# Altium schematic sheet modified.SchDoc
size A3
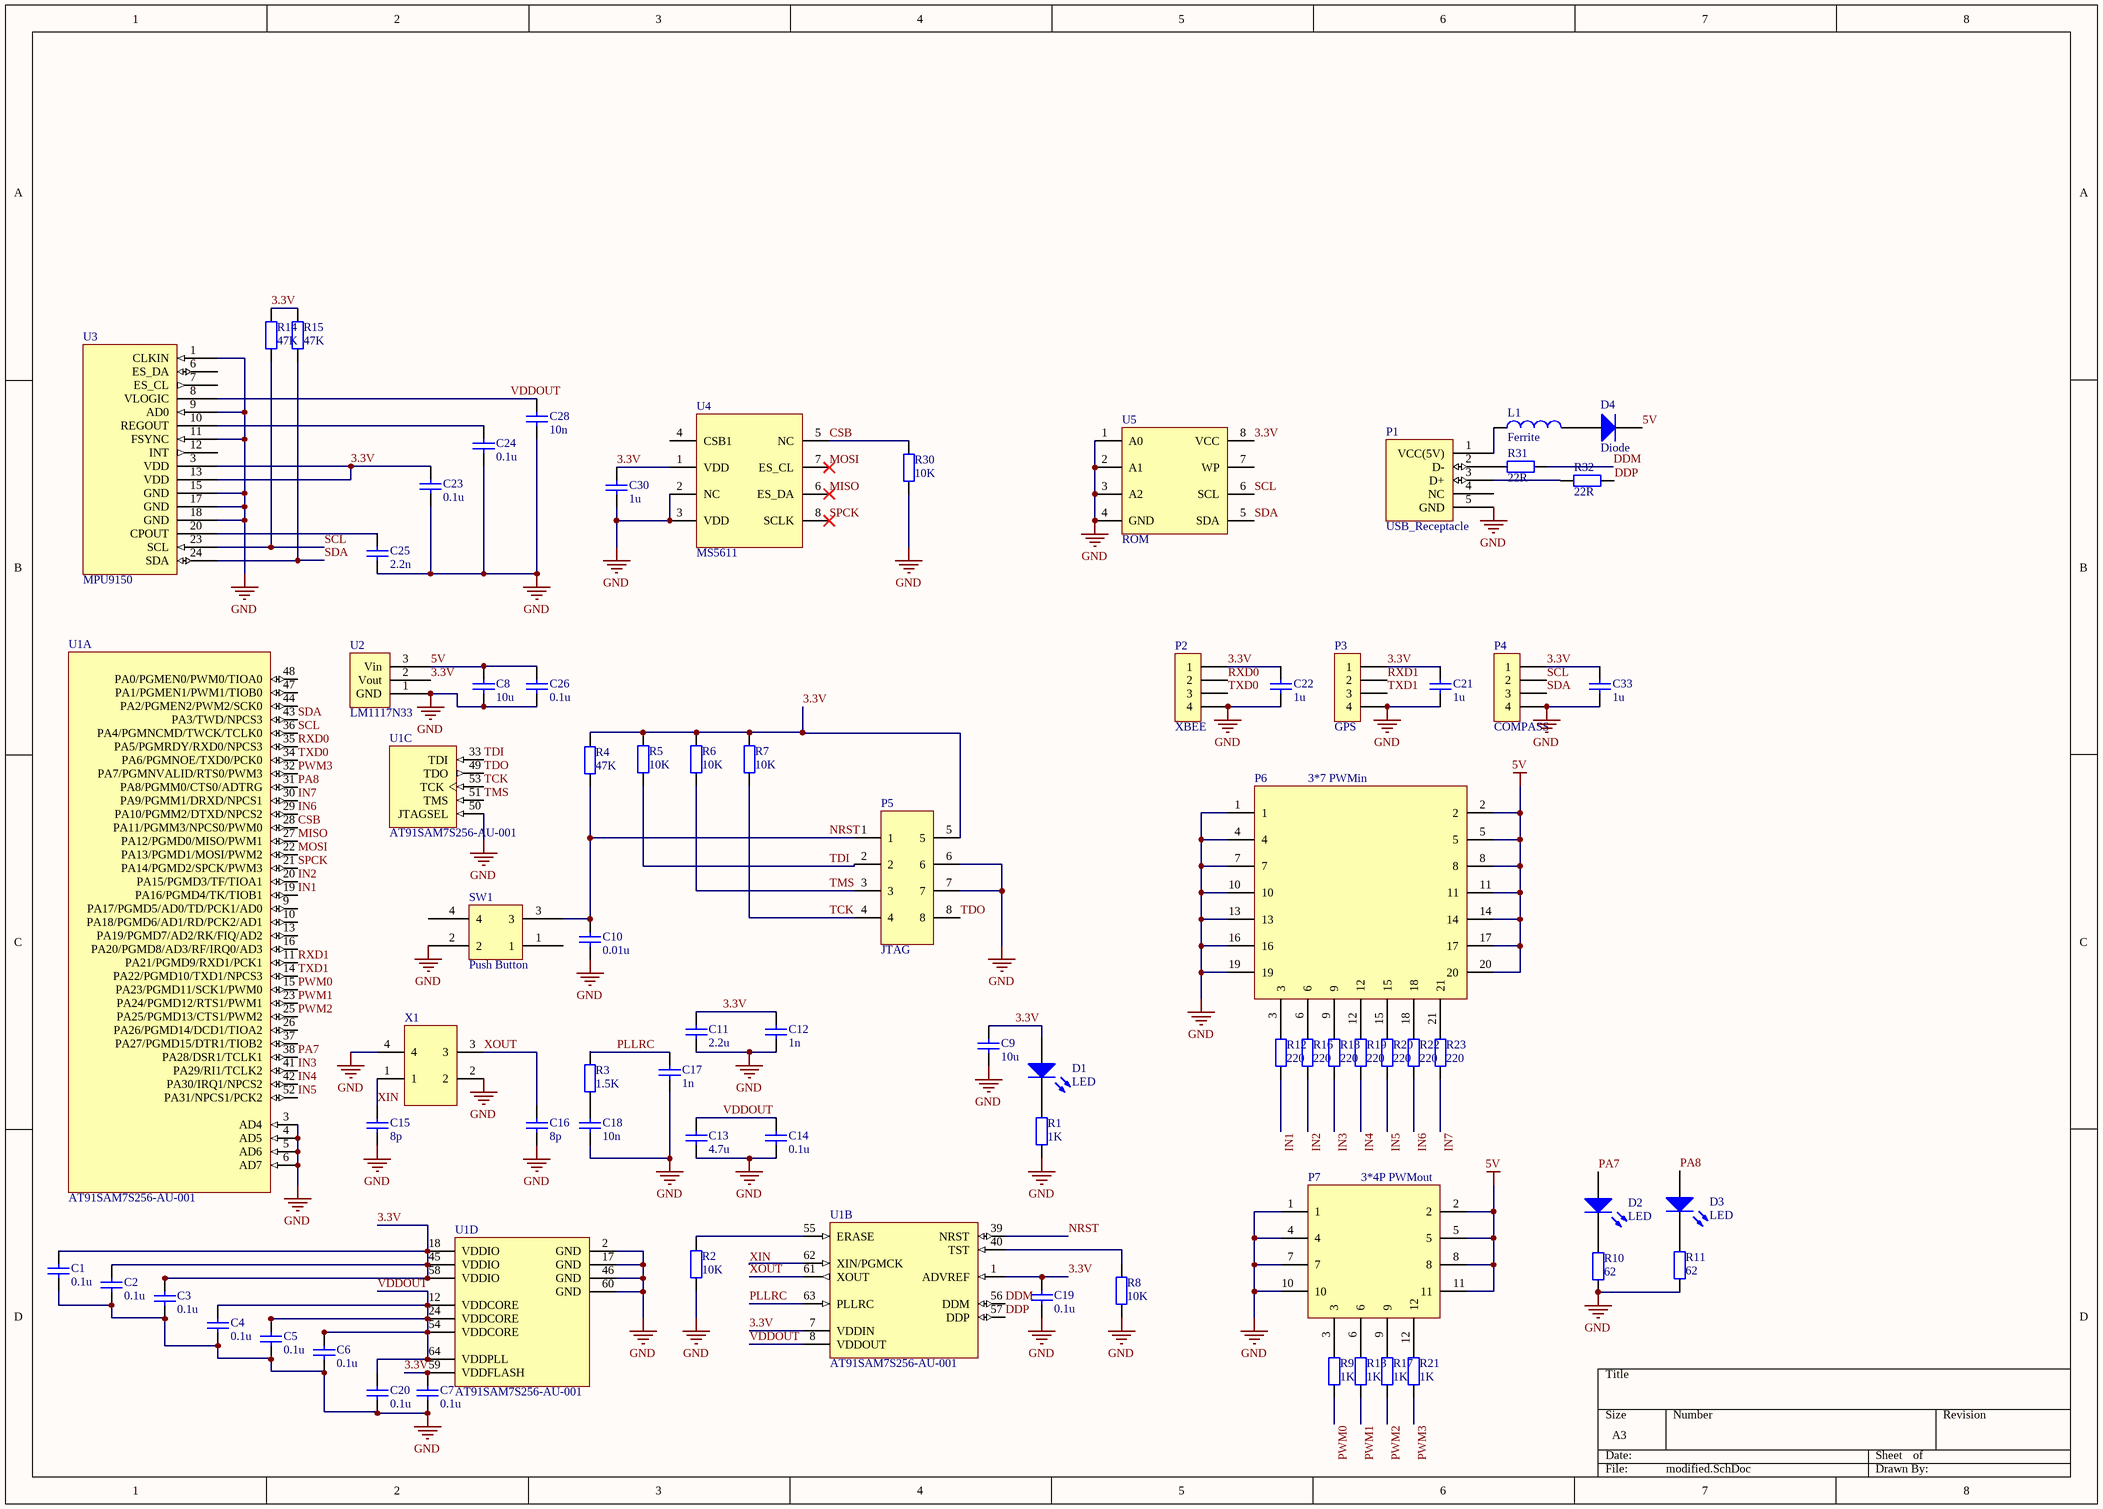
[diagram p0: modified.SchDoc]

## Parts
C1  0.1u  [1608[0603]]
C2  0.1u  [1608[0603]]
C3  0.1u  [1608[0603]]
C4  0.1u  [1608[0603]]
C5  0.1u  [1608[0603]]
C6  0.1u  [1608[0603]]
C7  0.1u  [1608[0603]]
C8  10u  [1206]
C9  10u  [1206]
C10  0.01u  [1608[0603]]
C11  2.2u  [0805]
C12  1n  [1608[0603]]
C13  4.7u  [0805]
C14  0.1u  [1608[0603]]
C15  8p  [1608[0603]]
C16  8p  [1608[0603]]
C17  1n  [1608[0603]]
C18  10n  [1608[0603]]
C19  0.1u  [1608[0603]]
C20  0.1u  [1608[0603]]
C21  1u  [1608[0603]]
C22  1u  [1608[0603]]
C23  0.1u  [1608[0603]]
C24  0.1u  [1608[0603]]
C25  2.2n  [1608[0603]]
C26  0.1u  [1608[0603]]
C28  10n  [1608[0603]]
C30  1u  [1608[0603]]
C33  1u  [1608[0603]]
D1  LED  [LED]
D2  LED  [LED]
D3  LED  [LED]
D4  Diode  [SMC]
L1  Ferrite  [0402-A]
P1  USB_Receptacle  [USB_Mini-B_Molex_SMT]
P2  XBEE  [Header 4p 2.0mm]
P3  GPS  [new GPS 1.25x5]
P4  COMPASS  [Compass]
P5  JTAG  [JTAG2]
P6  3*7 PWMin  [HEADER3X7]
P7  3*4P PWMout  [header3x4]
R1  1K  [1608[0603]]
R2  10K  [1608[0603]]
R3  1.5K  [1608[0603]]
R4  47K  [1608[0603]]
R5  10K  [1608[0603]]
R6  10K  [1608[0603]]
R7  10K  [1608[0603]]
R8  10K  [1608[0603]]
R9  1K  [1608[0603]]
R10  62  [1608[0603]]
R11  62  [1608[0603]]
R12  220  [1608[0603]]
R13  1K  [1608[0603]]
R14  47K  [1608[0603]]
R15  47K  [1608[0603]]
R16  220  [1608[0603]]
R17  1K  [1608[0603]]
R18  220  [1608[0603]]
R19  220  [1608[0603]]
R20  220  [1608[0603]]
R21  1K  [1608[0603]]
R22  220  [1608[0603]]
R23  220  [1608[0603]]
R30  10K  [1608[0603]]
R31  22R  [1608[0603]]
R32  22R  [1608[0603]]
SW1  Push Button  [Push Button]
U1  AT91SAM7S256-AU-001  [LQFP64_N]  (parts A,B,C,D of 4)
U2  LM1117N33  [SOT230P700X180-4N]
U3  MPU9150  [LGANEW]
U4  MS5611  [MS5611]
U5  ROM
X1  (no value)  [OSC2]

## Nets
5V: C8.2 C26.2 D4.2(K) P6.2 P6.5 P6.8 P6.11 P6.14 P6.17 P6.20 P7.2 P7.5 P7.8 P7.11 U2.3(Vin)
GND: C1.1 C2.1 C3.1 C4.1 C5.1 C6.1 C7.1 C8.1 C9.1 C10.1 C11.1 C12.1 C13.1 C14.1 C15.1 C16.1 C17.1 C18.1 C19.1 C20.1 C21.1 C22.1 C23.1 C24.1 C25.1 C26.1 C28.1 C30.1 C33.1 P1.5(GND) P2.4 P3.4 P4.4 P5.6 P5.7 P6.1 P6.4 P6.7 P6.10 P6.13 P6.16 P6.19 P7.1 P7.4 P7.7 P7.10 R1.1 R2.1 R8.1 R10.1 R11.1 R30.1 SW1.2 U1.2(GND) U1.3(AD4) U1.4(AD5) U1.5(AD6) U1.6(AD7) U1.17(GND) U1.46(GND) U1.50(JTAGSEL) U1.60(GND) U2.1(GND) U3.1(CLKIN) U3.9(AD0) U3.11(FSYNC) U3.15(GND) U3.17(GND) U3.18(GND) U4.2(NC) U4.3(VDD) U5.1(A0) U5.2(A1) U5.3(A2) U5.4(GND) X1.2 X1.4
3.3V: C1.2 C2.2 C3.2 C7.2 C9.2 C11.2 C12.2 C19.2 C21.2 C22.2 C23.2 C30.2 C33.2 D1.1(A) P2.1 P3.1 P4.1 P5.5 R4.2 R5.2 R6.2 R7.2 R14.1 R15.1 U1.1(ADVREF) U1.7(VDDIN) U1.18(VDDIO) U1.45(VDDIO) U1.58(VDDIO) U1.59(VDDFLASH) U2.2(Vout) U3.3(VDD) U3.13(VDD) U4.1(VDD) U5.8(VCC)
CSB: R30.2 U1.28(PA11/PGMM3/NPCS0/PWM0) U4.5(NC)
DDM: R31.2 U1.56(DDM)
DDP: R32.2 U1.57(DDP)
IN1: R12.1 U1.19(PA16/PGMD4/TK/TIOB1)
IN2: R16.1 U1.20(PA15/PGMD3/TF/TIOA1)
IN3: R18.1 U1.41(PA29/RI1/TCLK2)
IN4: R19.1 U1.42(PA30/IRQ1/NPCS2)
IN5: R20.1 U1.52(PA31/NPCS1/PCK2)
IN6: R22.1 U1.29(PA10/PGMM2/DTXD/NPCS2)
IN7: R23.1 U1.30(PA9/PGMM1/DRXD/NPCS1)
MISO: U1.27(PA12/PGMD0/MISO/PWM1) U4.6(ES_DA)
MOSI: U1.22(PA13/PGMD1/MOSI/PWM2) U4.7(ES_CL)
NRST: C10.2 P5.1 R4.1 SW1.3 U1.39(NRST)
PA7: D2.1(A) U1.38(PA28/DSR1/TCLK1)
PA8: D3.1(A) U1.31(PA8/PGMM0/CTS0/ADTRG)
PLLRC: C17.2 R3.2 U1.63(PLLRC)
PWM0: R9.1 U1.15(PA23/PGMD11/SCK1/PWM0)
PWM1: R13.1 U1.23(PA24/PGMD12/RTS1/PWM1)
PWM2: R17.1 U1.25(PA25/PGMD13/CTS1/PWM2)
PWM3: R21.1 U1.32(PA7/PGMNVALID/RTS0/PWM3)
RXD0: P2.2 U1.35(PA5/PGMRDY/RXD0/NPCS3)
RXD1: P3.2 U1.11(PA21/PGMD9/RXD1/PCK1)
SCL: P4.2 R14.2 U1.36(PA4/PGMNCMD/TWCK/TCLK0) U3.23(SCL) U5.6(SCL)
SDA: P4.3 R15.2 U1.43(PA3/TWD/NPCS3) U3.24(SDA) U5.5(SDA)
SPCK: U1.21(PA14/PGMD2/SPCK/PWM3) U4.8(SCLK)
TCK: P5.4 R7.1 U1.53(TCK)
TDI: P5.2 R5.1 U1.33(TDI)
TDO: P5.8 U1.49(TDO)
TMS: P5.3 R6.1 U1.51(TMS)
TXD0: P2.3 U1.34(PA6/PGMNOE/TXD0/PCK0)
TXD1: P3.3 U1.14(PA22/PGMD10/TXD1/NPCS3)
VDDOUT: C4.2 C5.2 C6.2 C13.2 C14.2 C20.2 C28.2 U1.8(VDDOUT) U1.12(VDDCORE) U1.24(VDDCORE) U1.54(VDDCORE) U1.64(VDDPLL) U3.8(VLOGIC)
XIN: C15.2 U1.62(XIN/PGMCK) X1.1
XOUT: C16.2 U1.61(XOUT) X1.3
NetC18_2: C18.2 R3.1
NetC24_2: C24.2 U3.10(REGOUT)
NetC25_2: C25.2 U3.20(CPOUT)
NetD1_2: D1.2(K) R1.2
NetD2_2: D2.2(K) R10.2
NetD3_2: D3.2(K) R11.2
NetD4_1: D4.1(A) L1.2
NetL1_1: L1.1 P1.1(VCC(5V))
NetP1_2: P1.2(D-) R31.1
NetP1_3: P1.3(D+) R32.1
NetP6_3: P6.3 R12.2
NetP6_6: P6.6 R16.2
NetP6_9: P6.9 R18.2
NetP6_12: P6.12 R19.2
NetP6_15: P6.15 R20.2
NetP6_18: P6.18 R22.2
NetP6_21: P6.21 R23.2
NetP7_3: P7.3 R9.2
NetP7_6: P7.6 R13.2
NetP7_9: P7.9 R17.2
NetP7_12: P7.12 R21.2
NetR2_2: R2.2 U1.55(ERASE)
NetR8_2: R8.2 U1.40(TST)

Not connected (* = marked no-connect by the designer): P1 4(NC); SW1 1 4; U1 9(PA17/PGMD5/AD0/TD/PCK1/AD0) 10(PA18/PGMD6/AD1/RD/PCK2/AD1) 13(PA19/PGMD7/AD2/RK/FIQ/AD2) 16(PA20/PGMD8/AD3/RF/IRQ0/AD3) 26(PA26/PGMD14/DCD1/TIOA2) 37(PA27/PGMD15/DTR1/TIOB2) 44(PA2/PGMEN2/PWM2/SCK0) 47(PA1/PGMEN1/PWM1/TIOB0) 48(PA0/PGMEN0/PWM0/TIOA0); U2 4(NC); U3 2(NC) 4(NC) 5(NC) 6(ES_DA) 7(ES_CL) 12(INT) 14(NC) 16(NC) 19(NC) 21(NC) 22(NC); U4 4(CSB1); U5 7(WP)

## Library data of the parts
C1-C7 C10 C12 C14-C25 C28 C30 C33 = Cap 0603: 0603 Capacitor; Published: 8-Jun-2000; LatestRevisionDate: 17-Jul-2002; LatestRevisionNote: Re-released for DXP Platform.; PackageReference: RAD-0.3; Publisher: Altium Limited; PackageDescription: Radial Cap, Thru-Hole; 2 Leads; 0.3 in Pin Spacing
C8 C9 C26 = Cap 1206: 1206 Capacitor; Published: 8-Jun-2000; LatestRevisionDate: 17-Jul-2002; LatestRevisionNote: Re-released for DXP Platform.; PackageReference: RAD-0.3; Publisher: Altium Limited; PackageDescription: Radial Cap, Thru-Hole; 2 Leads; 0.3 in Pin Spacing
C11 C13 = Cap 0805: 0805 Capacitor; Published: 8-Jun-2000; LatestRevisionDate: 17-Jul-2002; LatestRevisionNote: Re-released for DXP Platform.; PackageReference: RAD-0.3; Publisher: Altium Limited; PackageDescription: Radial Cap, Thru-Hole; 2 Leads; 0.3 in Pin Spacing
D1-D3 = LED: Typical RED, GREEN, YELLOW, AMBER GaAs LED; Published: 8-Jun-2000; LatestRevisionDate: 17-Jul-2002; LatestRevisionNote: Re-released for DXP Platform.; PackageVersion: Feb-2002; PackageReference: 3.2X1.6X1.1; Publisher: Altium Limited; PackageDescription: SM LED; 2 Flat Leads
D4 = Diode: Default Diode; Published: 8-Jun-2000; LatestRevisionDate: 17-Jul-2002; LatestRevisionNote: Re-released for DXP Platform.; PackageVersion: Sep-1996; PackageReference: SMC; Publisher: Altium Limited; PackageDescription: DO-214-AB/SMC; 2 C-Bend Leads; Body 7.9 x 5.9 mm, inc. leads (LxW); Code_JEDEC: DO-214-AB
L1 = Inductor: Code_IEC: 1005; Published: 8-Jun-2000; LatestRevisionDate: 29-May-2009; LatestRevisionNote: IPC-7351 Footprint Added.; PackageReference: 0402-A; Publisher: Altium Limited; PackageDescription: Chip Inductor; Code_JEITA: 0402
P2 = XBEE: Header, 4-Pin; LatestRevisionDate: 17-Jul-2002; LatestRevisionNote: Re-released for DXP Platform.; Publisher: Altium Limited
P3 = GPS: Header, 4-Pin; LatestRevisionDate: 17-Jul-2002; LatestRevisionNote: Re-released for DXP Platform.; Publisher: Altium Limited
P4 = COMPASS: Header, 4-Pin; LatestRevisionDate: 17-Jul-2002; LatestRevisionNote: Re-released for DXP Platform.; Publisher: Altium Limited
P5 = JTAG2
P6 = MyPWMin
P7 = MyPWMout
R1-R23 R30-R32 = Res 0603: Resistor
  R1-R8 R10-R12 R14-R16 R18-R20 R22 R23 R30-R32: Published: 8-Jun-2000; LatestRevisionDate: 17-Jul-2002; LatestRevisionNote: Re-released for DXP Platform.; PackageReference: AXIAL-0.4; Publisher: Altium Limited; PackageDescription: Axial Device, Thru-Hole; 2 Leads; 0.4 in Pin Spacing
U1 = AT91SAM7S256-AU-001: AT91 ARM Thumb-based 32-bit Microcontroller, 256KB Flash, 64KB SRAM, 64-Pin LQFP, 11-ch. PDC, Industrial Grade (-40癈 to 85癈), Pb-Free; Published: 16-Oct-2006; DatasheetVersion: revJ, Dec-2009; PackageVersion: Apr-2006; PackageReference: LQFP64; Publisher: Altium Limited; PackageDescription: 64-Pin Thin Quad Flat Pack 0.5 mm Pitch; Supplier 1: Digi-Key; Supplier Part Number 1: AT91SAM7S256AU001-ND; Supplier 2: Farnell; Supplier Part Number 2: 1095460; Supplier 3: Farnell; Supplier Part Number 3: 1528287; Supplier 4: Mouser; Supplier Part Number 4: 556-A91SAM7S256AU001; Code_JEDEC: MS-026-BCD; ComponentLink1Description: Manufacturer Link; ComponentLink1URL: http://www.atmel.com/products/AT91/default.asp?; ComponentLink2Description: AT91SAM7S Series Datasheet; ComponentLink2URL: http://www.atmel.com/dyn/resources/prod_documents/doc6175.pdf; ComponentLink3Description: AT91SAM7S Series Summary; ComponentLink3URL: http://www.atmel.com/dyn/resources/prod_documents/6175s.pdf; ComponentLink4Description: ARM7TDMI Reference Manual; ComponentLink4URL: http://www.atmel.com/dyn/resources/prod_documents/DDI0029G_7TDMI_R3_trm.pdf; ComponentLink5Description: Atmel.com Home; ComponentLink5URL: http://www.atmel.com
U2 = LM1117S33: 3.3V Regulator
X1 = OSC2